# Altium schematic sheet Telemetry.SchDoc
size 381 x 241 mm; SheetNumber: 1; SheetTotal: 10
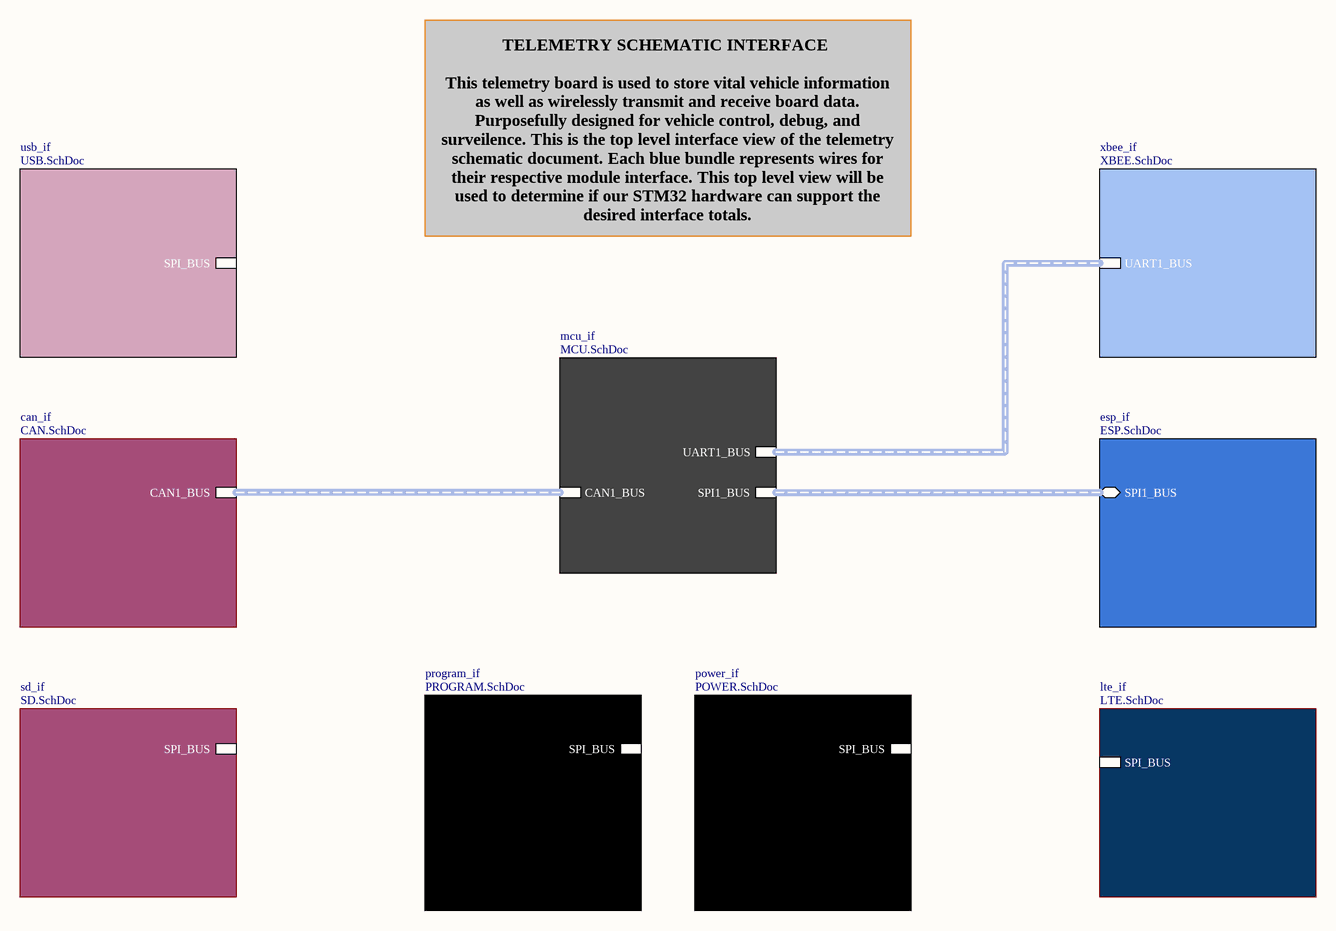
[diagram p0: Telemetry.SchDoc]

## Sub-sheets
can_if = CAN.SchDoc: CAN1_BUS (harness SPI_BUS)
esp_if = ESP.SchDoc: SPI1_BUS (bidir, harness SPI_BUS)
lte_if = LTE.SchDoc: SPI_BUS (harness SPI_BUS)
mcu_if = MCU.SchDoc: SPI1_BUS (harness SPI_BUS), UART1_BUS (harness SPI_BUS), CAN1_BUS (harness SPI_BUS)
power_if = POWER.SchDoc: SPI_BUS (harness SPI_BUS)
program_if = PROGRAM.SchDoc: SPI_BUS (harness SPI_BUS)
sd_if = SD.SchDoc: SPI_BUS (harness SPI_BUS)
usb_if = USB.SchDoc: SPI_BUS (harness SPI_BUS)
xbee_if = XBEE.SchDoc: UART1_BUS (harness SPI_BUS)

## Buses and harness runs
harness sheet can_if/CAN1_BUS = sheet mcu_if/CAN1_BUS
harness sheet esp_if/SPI1_BUS = sheet mcu_if/SPI1_BUS
harness sheet mcu_if/UART1_BUS = sheet xbee_if/UART1_BUS

## Notes on the sheet
- TELEMETRY SCHEMATIC INTERFACE
  This telemetry board is used to store vital vehicle information as well as wirelessly transmit and receive board data. Purposefully designed for vehicle control, debug, and surveilence. This is the top level interface view of the telemetry schematic document. Each blue bundle represents wires for their respective module interface. This top level view will be used to determine if our STM32 hardware can support the desired interface totals.